# Altium schematic sheet 无线传感狗启.SCHDOC
size A4; PageSetup: Record=PageOptions|CenterHorizontal=True|CenterVertical=True|PrintScale=0.96|XCorrection=1.00|YCorrection=1.00|PrintKind=2|BorderSize=5000000|LeftOffset=0|BottomOffset=0|Orientation=2|PaperLength=1000|PaperWidth=1000|Scale=100|PaperSource=7|PrintQuality=-4|MediaType=1|DitherType=10|PaperKind=A4|PrintScaleMode=1
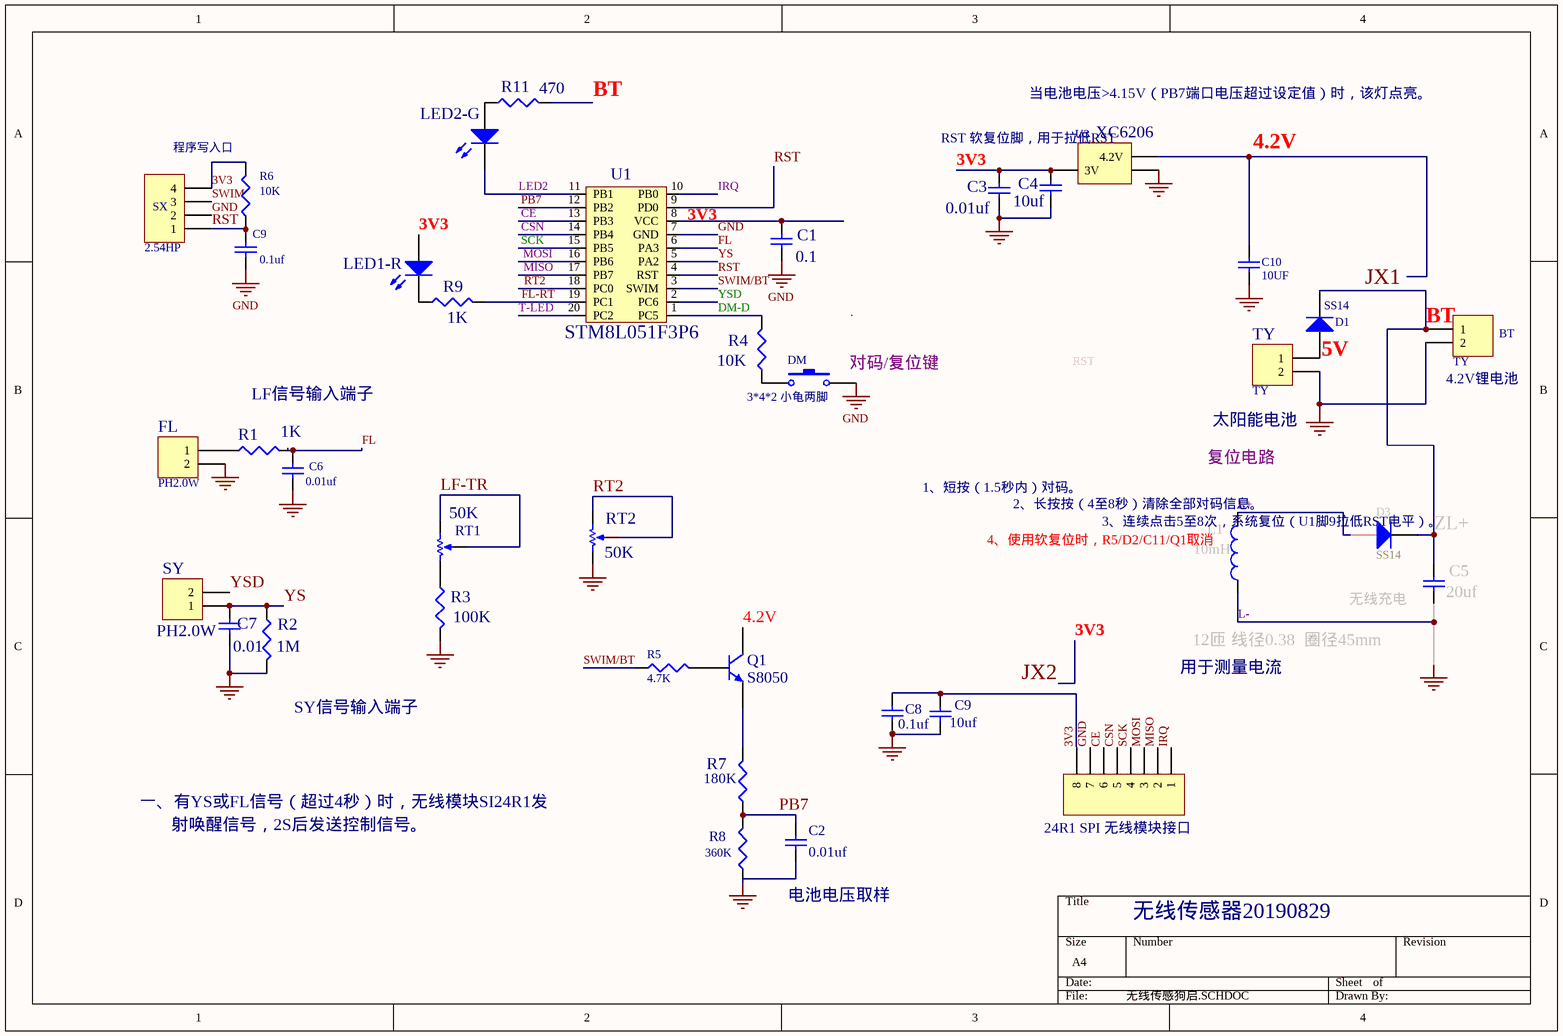
[diagram p0: 无线传感狗启.SCHDOC]

## Parts
(Parts that share a designator on the sheet are numbered #1, #2 ... from top to bottom, then left to right.)
24R1_SPI_无线模块接口  Header 8  [HDR1X8]  (value not drawn)
BT  TY  [HDR1X2]
C1  value 0.1  [CC1608-0603]
C2  0.01uf  [CC1608-0603]
C3  value 0.01uf  [CC1608-0603]
C4  value 10uf  [CC1608-0603]
C5  value 20uf  [CC1608-0603]
C6  0.01uf  [CC1608-0603]
C7  0.01  [CC1608-0603]
C8  0.1uf  [CC1608-0603]
C9#1  value 0.1uf  [CC1608-0603]  (hidden comment: Cap Semi)
C9#2  10uf  [CC1608-0603]
C10  value 10UF  [CC1608-0603]
D1  SS14  [DIO7.1-3.9x1.9]
D3  SS14  [DIO7.1-3.9x1.9]
DM  3*4*2 小龟两脚  [SPST-2]
FL  PH2.0W  [HDR1X2]
L1  12匝 线径0.38  圈径45mm  value 10mH  [INDC1005-0402]
LED1-R  (no value)  [LED-0]
LED2-G  (no value)  [LED-0]
Q1  S8050  [BCY-W3/E4]
R1  value 1K  [C1608-0603]
R2  value 1M  [C1608-0603]
R3  value 100K  [C1608-0603]
R4  value 10K  [C1608-0603]
R5  4.7K  [C1608-0603]
R6  value 10K  [C1608-0603]
R7  value 180K  [C1608-0603]
R8  value 360K  [C1608-0603]
R9  1K  [C1608-0603]
R11  470  [C1608-0603]
RT1  50K  [VR5]
RT2  50K  [VR5]
SX  2.54HP  [HDR1X4]
SY  PH2.0W  [HDR1X2]
TY  TY  [HDR1X2]
U1  STM8L051F3P6  [TSSOP20]
U3  XC6206  [MHDR2X2]

## Nets
GND: 24R1_SPI_无线模块接口.7 BT.2 C1.1 C2.1 C3.1 C4.2 C5.2 C6.1 C7.1 C8.1 C9#1.1 C9#2.1 C10.2 DM.2 FL.2 L1.2 R2.1 R3.1 R8.1 RT2.2(BOT) SX.2 TY.2 U1.7(GND) U3.3.3OUT  [also labelled L-]
3V3: 24R1_SPI_无线模块接口.8 C3.2 C4.1 LED1-R.1(A) R6.2 SX.4 U3.2(3V)
4.2V: Q1.3(C)
BT: BT.1 C5.1 D1.2(K) D3.2(K) R11.2  [also labelled JX1, ZL+]
CE: 24R1_SPI_无线模块接口.6 U1.13(PB3)
CSN: 24R1_SPI_无线模块接口.5 U1.14(PB4)
DM-D: R4.2 U1.1(PC5)
FL: C6.2 R1.1 U1.6(PA3)
FL-RT: R9.2 U1.19(PC1)
IRQ: 24R1_SPI_无线模块接口.1 U1.10(PB0)
L+: D3.1(A) L1.1
LED2: LED2-G.2(K) U1.11(PB1)
LF-TR: RT1.1(TOP) RT1.3(TAP)
MISO: 24R1_SPI_无线模块接口.2 U1.17(PB7)
MOSI: 24R1_SPI_无线模块接口.3 U1.16(PB6)
PB7: C2.2 R7.1 R8.2 U1.12(PB2)
RST: C9#1.2 R6.1 SX.1 U1.4(RST) U1.9(PD0)
RT2: RT2.1(TOP) RT2.3(TAP) U1.18(PC0)
SCK: 24R1_SPI_无线模块接口.4 U1.15(PB5)
SWIM: SX.3
SWIM/BT: R5.2 U1.3(SWIM)
T-LED: U1.20(PC2)
YS: C7.2 R2.2 SY.1 U1.5(PA2)
YSD: SY.2 U1.2(PC6)
NetC1_2: C1.2 U1.8(VCC)
NetC8_2: C8.2 C9#2.2
NetC10_1: C10.1 U3.3.3_IN(4.2V)
NetD1_1: D1.1(A) TY.1
NetDM_1: DM.1 R4.1
NetFL_1: FL.1 R1.2
NetLED1-R_2: LED1-R.2(K) R9.1
NetLED2-G_1: LED2-G.1(A) R11.1
NetQ1_1: Q1.1(E) R7.2
NetQ1_2: Q1.2(B) R5.1
NetR3_2: R3.2 RT1.2(BOT)

## Notes on the sheet
- 当电池电压>4.15V（PB7端口电压超过设定值）时，该灯点亮。
- 程序写入口
- RST 软复位脚，用于拉低RST
- (near BT) 4.2V锂电池
- LF信号输入端子
- 太阳能电池
- 1、短按（1.5秒内）对码。
- 2、长按按（4至8秒）清除全部对码信息。
- 4、使用软复位时，R5/D2/C11/Q1取消
- 3、连续点击5至8次，系统复位（U1脚9拉低RST电平）。
- 无线充电
- (near R2) SY信号输入端子
- 用于测量电流
- 一、有YS或FL信号（超过4秒）时，无线模块SI24R1发
- 射唤醒信号，2S后发送控制信号。
- 电池电压取样
- 无线传感器20190829
- Labels drawn without touching a wire or pin: 3V3, 4.2V, 5V, JX2, RST, 复位电路, 对码/复位键

## Library data of the parts
24R1_SPI_无线模块接口 = Header 8: Header, 8-Pin; LatestRevisionDate: 17-Jul-2002; LatestRevisionNote: Re-released for DXP Platform.; Publisher: Altium Limited
BT FL SY TY = Header 2: Header, 2-Pin; LatestRevisionDate: 17-Jul-2002; LatestRevisionNote: Re-released for DXP Platform.; Publisher: Altium Limited
C1 C3-C5 C9#1 C10 = Cap Semi: Capacitor (Semiconductor SIM Model); Published: 8-Jun-2000; LatestRevisionDate: 17-Jul-2002; LatestRevisionNote: Re-released for DXP Platform.; PackageReference: C1206; Publisher: Altium Limited
C2 C6 C7 C9#2 = Cap Semi: Capacitor (Semiconductor SIM Model); Value: 100pF; Published: 8-Jun-2000; LatestRevisionDate: 17-Jul-2002; LatestRevisionNote: Re-released for DXP Platform.; PackageReference: C1206; Publisher: Altium Limited
C8 = Cap Semi: Capacitor (Semiconductor SIM Model); Value: 10UF; Published: 8-Jun-2000; LatestRevisionDate: 17-Jul-2002; LatestRevisionNote: Re-released for DXP Platform.; PackageReference: C1206; Publisher: Altium Limited
D1 D3 = Diode 1N4148: High Conductance Fast Diode; Published: 8-Jun-2000; LatestRevisionDate: 17-Jul-2002; LatestRevisionNote: Re-released for DXP Platform.; Publisher: Altium Limited; Code_JEDEC: DO-204-AH; DatasheetDocument: 1997; PackageReference: DO-35
DM = SW-PB: Switch; Published: 24-Mar-1999; LatestRevisionDate: 17-Jul-2002; LatestRevisionNote: Re-released for DXP Platform.; Publisher: Altium Limited
L1 = Inductor: Code_IEC: 1005; Published: 8-Jun-2000; LatestRevisionDate: 17-Jul-2002; LatestRevisionNote: Re-released for DXP Platform.; PackageReference: 0402-A; Publisher: Altium Limited; Code_JEITA: 0402
LED1-R LED2-G = LED0: Typical INFRARED GaAs LED; Published: 8-Jun-2000; LatestRevisionDate: 17-Jul-2002; LatestRevisionNote: Re-released for DXP Platform.; Publisher: Altium Limited
Q1 = 2N3904: NPN General Purpose Amplifier; Published: 8-Jun-2000; LatestRevisionDate: 15-Jan-2003; LatestRevisionNote: PCB Footprint 'BCY-W3/D4.7' replaced; DatasheetDocument: 1997; PackageReference: TO-92A; Publisher: Altium Limited; Code_JEDEC: TO-92A
R1-R9 R11 = Res3: Resistor; Published: 8-Jun-2000; LatestRevisionDate: 17-Jul-2002; LatestRevisionNote: Re-released for DXP Platform.; Publisher: Altium Limited
RT1 RT2 = RPot: Potentiometer; Sim Note: Enter the Resistance value and the set point into parameter fields.; Set Position: 0.5; Published: 8-Jun-2000; LatestRevisionDate: 17-Jul-2002; LatestRevisionNote: Re-released for DXP Platform.; Publisher: Altium Limited
SX = Header 4: Header, 4-Pin; LatestRevisionDate: 17-Jul-2002; LatestRevisionNote: Re-released for DXP Platform.; Publisher: Altium Limited
U1 = STM8L051
U3 = MHDR2X2: Header, 2-Pin, Dual row; LatestRevisionDate: 17-Jul-2002; LatestRevisionNote: Re-released for DXP Platform.; Publisher: Altium Limited